# EAGLE design Seeeduino XIAO_v1.0_191112 (EAGLE 9.3.1)
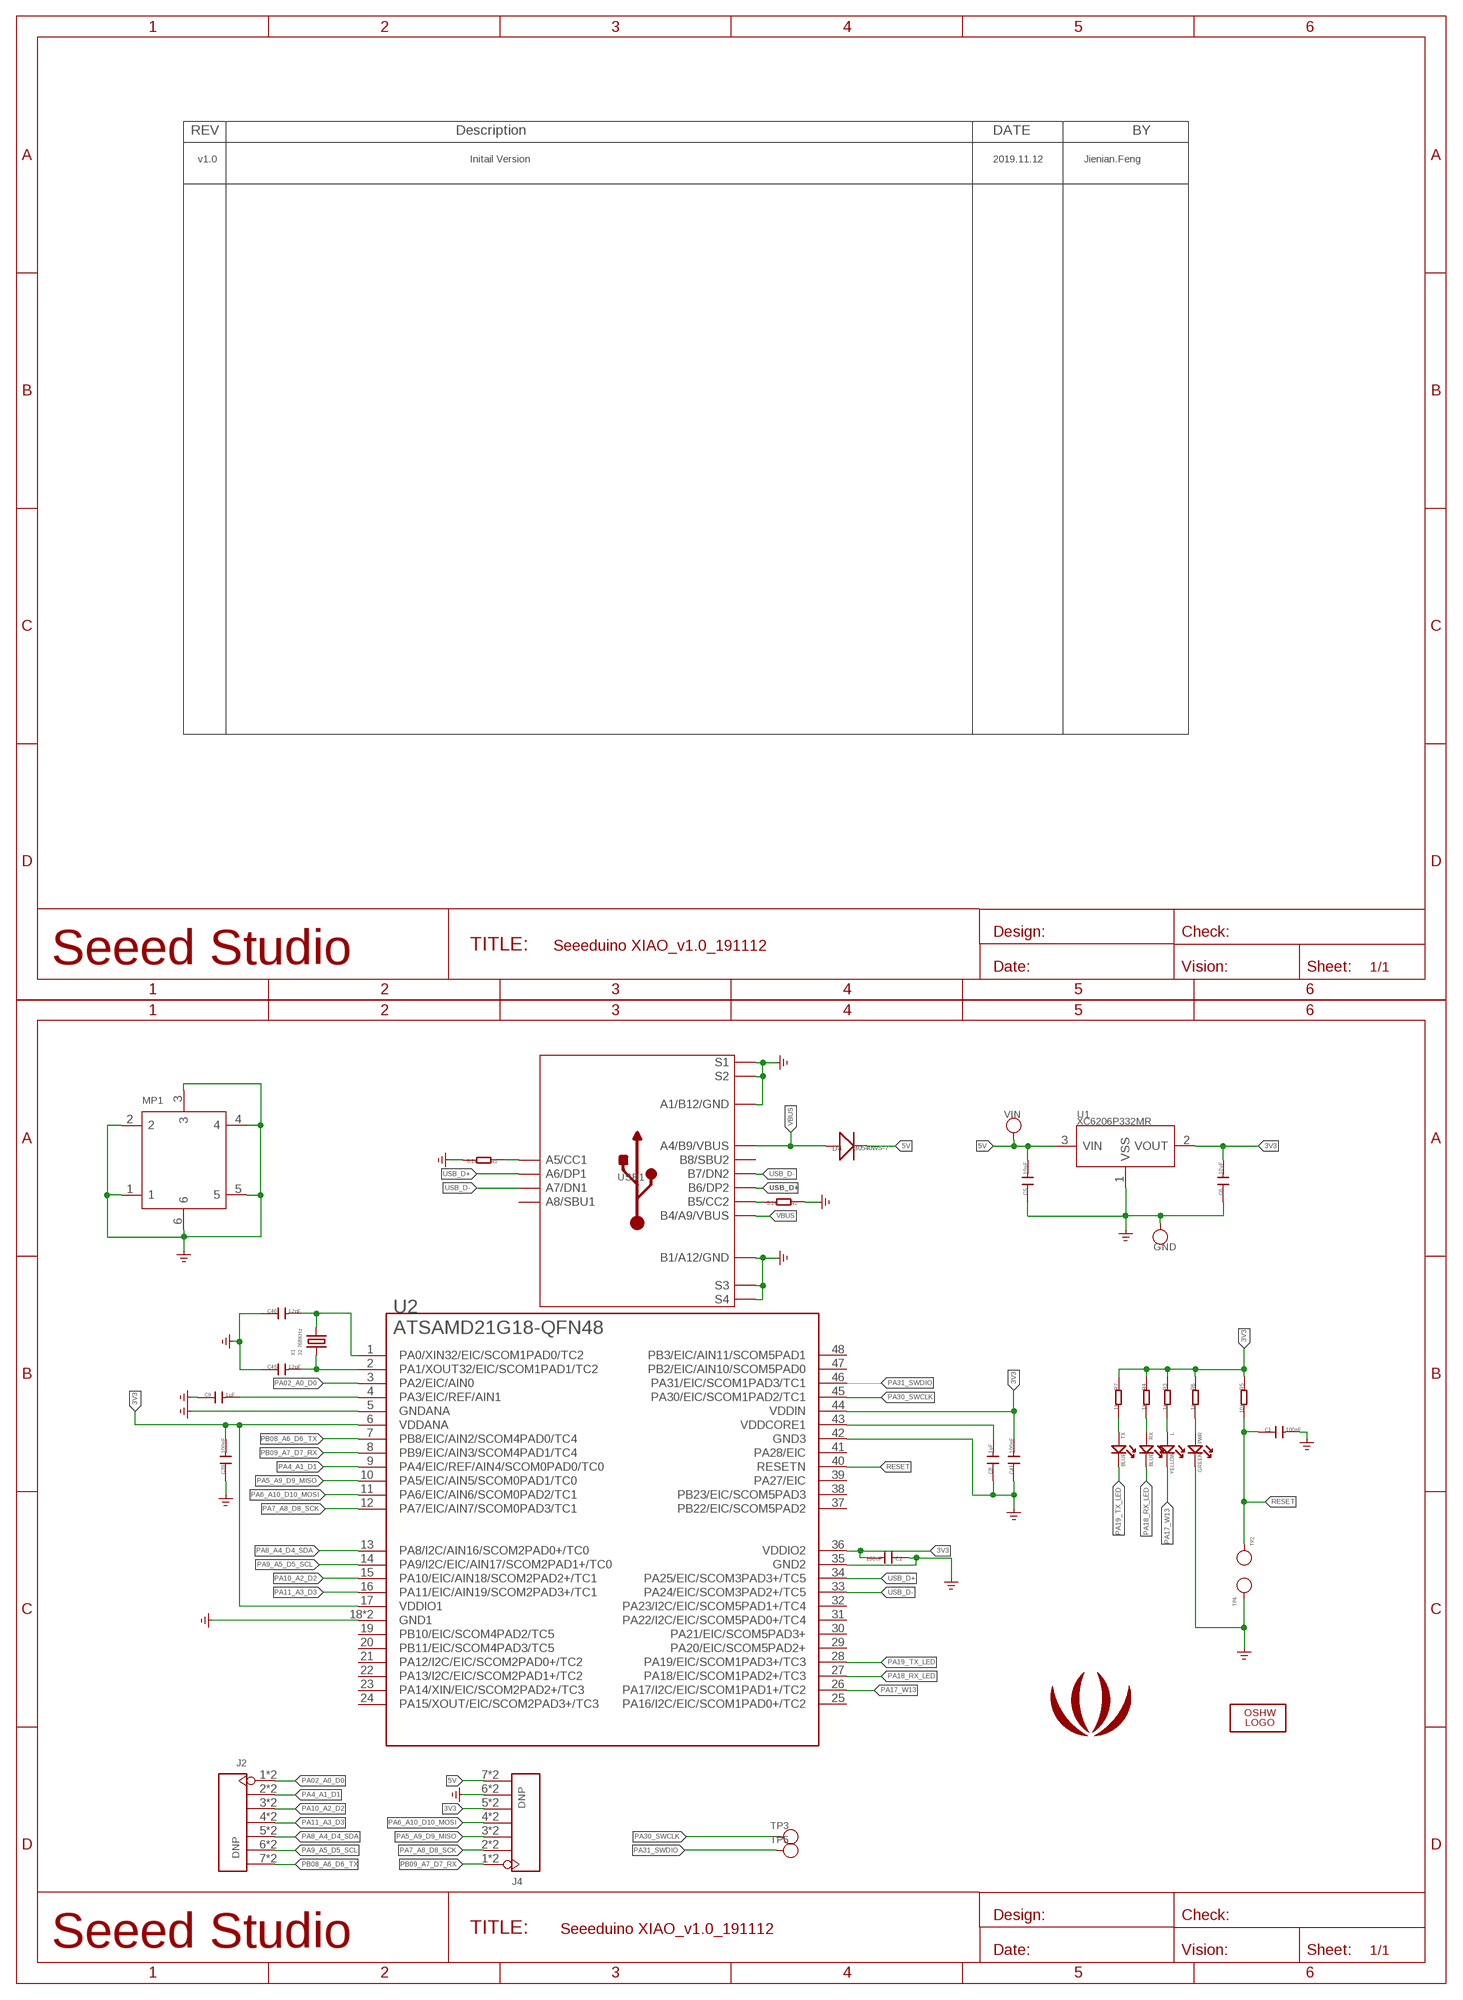
[diagram p0: schematic, sheet 1]

## Parts
C1  100nF  C-0402  [C0402]
C2  100nF  C-0402  [C0402]
C5  10uF  C-0603  [C0603]
C6  10uF  C-0603  [C0603]
C8  1uF  C-0402  [C0402]
C9  1uF  C-0402  [C0402]
C39  100nF  C-0402  [C0402]
C41  100nF  C-0402  [C0402]
C45  12pF  C-0402  [C0402]
C46  12pF  C-0402  [C0402]
D4  B0540WS-7  D'0805'  [SOD323]
GND  TEST-POINT'4080'  [TP-80X40MIL]
J2  DNP  HEADER-7P-HALF-HOLE-2.54  [H7-HALF-HOLE-2.54]
J4  DNP  HEADER-7P-HALF-HOLE-2.54  [H7-HALF-HOLE-2.54]
L  YELLOW  LED-0402  [LED-0402]
LOGO1  LOGO-OSHW-FILLX0200-NT  [OSHW_FILLX200_NOTEXT]
MP1  SHIELDING-COVER-12.3X11.9X0.2MM  [SHIELDING-COVER-12.3X11.9X0.2MM]
PWR  GREEN  LED-0402  [LED-0402]
R1  5.1k  R-0402  [R0402]
R2  5.1k  R-0402  [R0402]
R3  1k  R-0402  [R0402]
R4  1k  R-0402  [R0402]
R5  10k  R-0402  [R0402]
R6  1k  R-0402  [R0402]
R7  1k  R-0402  [R0402]
RX  BLUE  LED-0402  [LED-0402]
TP2  TEST-POINT'4545'  [TP-D45MIL]
TP3  TEST-POINT'4545'  [TP-D45MIL]
TP4  TEST-POINT'4545'  [TP-D45MIL]
TP5  TEST-POINT'4545'  [TP-D45MIL]
TX  BLUE  LED-0402  [LED-0402]
U1  XC6206P332MR  PMIC-XC6206PMR  [SOT-23]
U2  ATSAMD21G18-QFN48  [QFN48-7X7]
U$3  LOGO-SEEED-BIG-SILK  [SEEED-SILK-280*268MIL]
USB1  USB2.0-TYPE-C  [USB2.0-TYPE-C]
VIN  TEST-POINT'4080'  [TP-80X40MIL]
X1  32.768KHz  CRYSTAL-2P'NX2012SA'  [X2-SMD-L2.0X1.2X0.55MM]

## Nets
3V3: C2.2 C6.2 C39.2 C41.2 J4.5 J4.17 R3.1 R4.1 R5.1 R6.1 R7.1 U1.2(VOUT) U2.6(VDDANA) U2.17(VDDIO1) U2.36(VDDIO2) U2.44(VDDIN)
5V: C5.2 D4.- J4.7 J4.19 U1.3(VIN) VIN.1(T)
GND: C1.2 C2.1 C5.1 C6.1 C8.1 C9.1 C39.1 C41.1 C45.1 C46.1 GND.1(T) J4.6 J4.18 MP1.1 MP1.2 MP1.3 MP1.4 MP1.5 MP1.6 PWR.- R1.2 R2.1 TP4.T U1.1(VSS) U2.5(GNDANA) U2.18(GND1) U2.35(GND2) U2.42(GND3) U2.PAD(GND1) USB1.A1_B12(A1/B12/GND) USB1.B1_A12(B1/A12/GND) USB1.S1 USB1.S2 USB1.S3 USB1.S4 USB1.S5(S1) USB1.S6(S2) ; supply symbol labelled GND_POWER
N$1: R1.1 USB1.A5(A5/CC1)
N$2: R2.2 USB1.B5(B5/CC2)
N$3: C8.2 U2.43(VDDCORE1)
N$4: C9.2 U2.4(PA3/EIC/REF/AIN1)
N$5: L.+ R3.2
N$6: R7.2 TX.+
N$7: C45.2 U2.2(PA1/XOUT32/EIC/SCOM1PAD1/TC2) X1.2
N$9: R4.2 RX.+
N$11: C46.2 U2.1(PA0/XIN32/EIC/SCOM1PAD0/TC2) X1.1
N$16: PWR.+ R6.2
PA02_A0_D0: J2.1 J2.13 U2.3(PA2/EIC/AIN0)
PA4_A1_D1: J2.2 J2.14 U2.9(PA4/EIC/REF/AIN4/SCOM0PAD0/TC0)
PA5_A9_D9_MISO: J4.3 J4.15 U2.10(PA5/EIC/AIN5/SCOM0PAD1/TC0)
PA6_A10_D10_MOSI: J4.4 J4.16 U2.11(PA6/EIC/AIN6/SCOM0PAD2/TC1)
PA7_A8_D8_SCK: J4.2 J4.14 U2.12(PA7/EIC/AIN7/SCOM0PAD3/TC1)
PA8_A4_D4_SDA: J2.5 J2.17 U2.13(PA8/I2C/AIN16/SCOM2PAD0+/TC0)
PA9_A5_D5_SCL: J2.6 J2.18 U2.14(PA9/I2C/EIC/AIN17/SCOM2PAD1+/TC0)
PA10_A2_D2: J2.3 J2.15 U2.15(PA10/EIC/AIN18/SCOM2PAD2+/TC1)
PA11_A3_D3: J2.4 J2.16 U2.16(PA11/EIC/AIN19/SCOM2PAD3+/TC1)
PA17_W13: L.- U2.26(PA17/I2C/EIC/SCOM1PAD1+/TC2)
PA18_RX_LED: RX.- U2.27(PA18/EIC/SCOM1PAD2+/TC3)
PA19_TX_LED: TX.- U2.28(PA19/EIC/SCOM1PAD3+/TC3)
PA30_SWCLK: TP3.T U2.45(PA30/EIC/SCOM1PAD2/TC1)
PA31_SWDIO: TP5.T U2.46(PA31/EIC/SCOM1PAD3/TC1)
PB08_A6_D6_TX: J2.7 J2.19 U2.7(PB8/EIC/AIN2/SCOM4PAD0/TC4)
PB09_A7_D7_RX: J4.1 J4.13 U2.8(PB9/EIC/AIN3/SCOM4PAD1/TC4)
RESET: C1.1 R5.2 TP2.T U2.40(RESETN)
USB_D+: U2.34(PA25/EIC/SCOM3PAD3+/TC5) USB1.A6(A6/DP1) USB1.B6(B6/DP2)
USB_D-: U2.33(PA24/EIC/SCOM3PAD2+/TC5) USB1.A7(A7/DN1) USB1.B7(B7/DN2)
VBUS: D4.+ USB1.A4_B9(A4/B9/VBUS) USB1.B4_A9(B4/A9/VBUS)
Unconnected: U2.19(PB10/EIC/SCOM4PAD2/TC5) U2.20(PB11/EIC/SCOM4PAD3/TC5) U2.21(PA12/I2C/EIC/SCOM2PAD0+/TC2) U2.22(PA13/I2C/EIC/SCOM2PAD1+/TC2) U2.23(PA14/XIN/EIC/SCOM2PAD2+/TC3) U2.24(PA15/XOUT/EIC/SCOM2PAD3+/TC3) U2.25(PA16/I2C/EIC/SCOM1PAD0+/TC2) U2.29(PA20/EIC/SCOM5PAD2+) U2.30(PA21/EIC/SCOM5PAD3+) U2.31(PA22/I2C/EIC/SCOM5PAD0+/TC4) U2.32(PA23/I2C/EIC/SCOM5PAD1+/TC4) U2.37(PB22/EIC/SCOM5PAD2) U2.38(PB23/EIC/SCOM5PAD3) U2.39(PA27/EIC) U2.41(PA28/EIC) U2.47(PB2/EIC/AIN10/SCOM5PAD0) U2.48(PB3/EIC/AIN11/SCOM5PAD1) USB1.A8(A8/SBU1) USB1.B8(B8/SBU2)

## Notes on the sheet
- v1.0 | Initail Version | 2019.11.12 | Jienian.Feng

## Library data of the parts
C1 C2 C5 C6 C8 C9 C39 C41 C45 C46 = GroveX:C*: Ceramic Capacitors
D4 = Discrete-smallsmall:D*
GND VIN = Discrete-new:TEST-POINT
J2 J4 = Connector-new:HEADER-7P-HALF-HOLE
L PWR RX TX = Discrete-small:LED
LOGO1 = logo:LOGO-OSHW-FILL; PARTNO: DNP
MP1 = moudle-new:SHIELDING-COVER-12.3X11.9X0.2MM
R1-R7 = GroveX:R*
TP2-TP5 = Discrete-new:TEST-POINT; PARTNO: DNP
U1 = G2:PMIC-XC6206P: LOW ESR Cap.Compatible Positive Voltage Regulators
U2 = AMLib_New:ATSAMD21G18: Atmel D21 32bit ARM Cortex-M0 microcontroller - 48 PIN TQFP 256KB flash memory + 32KB SRAM
U$3 = logo:LOGO-SEEED; PARTNO: DNP
USB1 = USB C:USB2.0-TYPE-C
X1 = Discrete-new:CRYSTAL-2P

## Net classes
1 power: width 0.152 mm, drill 0.152 mm, clearance 0.152 mm
2 gnd: width 0.152 mm, drill 0.152 mm, clearance 0.152 mm
3 usbvcc: width 0.152 mm, drill 0.152 mm, clearance 0.152 mm

## Board
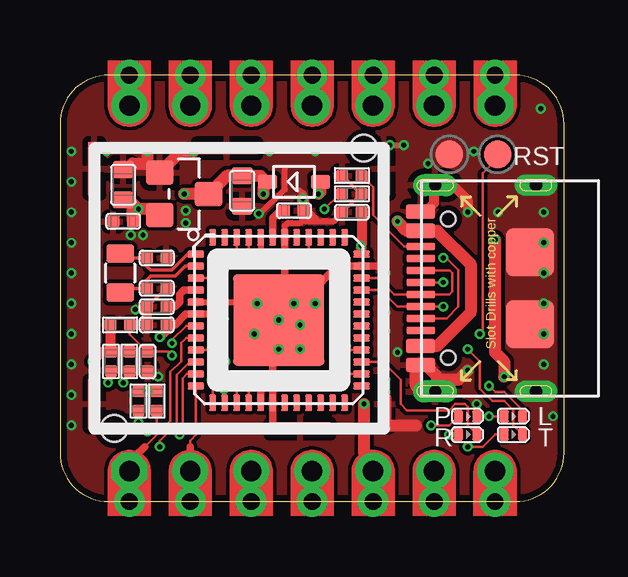
[diagram p1: board, top side]
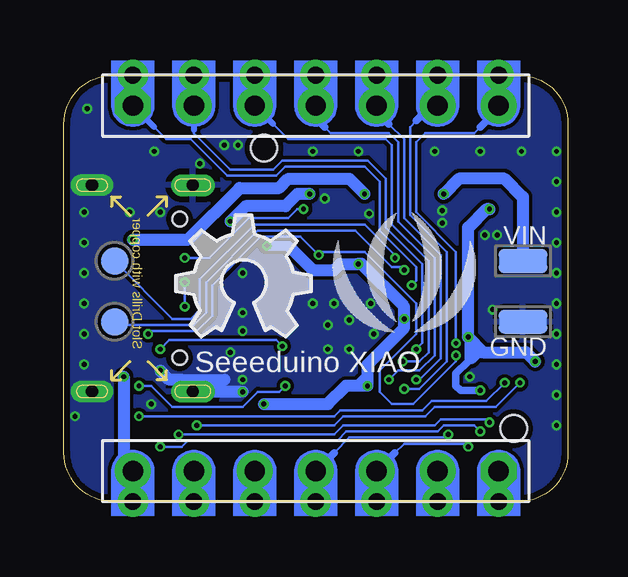
[diagram p2: board, bottom side, seen from below]

Size 21 x 17.78 mm. Coordinates in mm from the lower left corner, seen from the top.
Outline: 2.03,0 18.97,0 arc90 21,2.03 21,15.75 arc90 18.97,17.78 2.03,17.78 arc90 0,15.75 0,2.03 arc90 2.03,0
Copper layers (1*16): Top 0.035mm / dielectric 1.5mm / Bottom 0.035mm
Design rules "SeeedStudio_2layer_DRU_no_angle_20140221 *": minimum track width 1mil, minimum drill 8mil, track to track 4mil, track to pad 4mil, pad to pad 4mil, via to via 4mil, smd to smd 0mil, copper to edge 10mil, drill to drill 10mil, minimum pad ring 4mil, minimum via ring 4mil, stop-mask expansion 2mil, vias tented up to drill 25mil, thermal gap 10mil
tRestrict: area 6.2,4.4 to 11.9,10.3

### Footprints (pad centres in the part's own frame; a part is rotated, then mirrored left to right if it is on the bottom)
C0402 = smd 0.508 x 0.508: 1 -0.406,0; 2 0.406,0
C0603 = smd 0.699 x 0.862: 1 -0.635,0; 2 0.635,0
SOD323 = smd 0.8 x 0.6: + -1.1,0; - 1.1,0
TP-80X40MIL = smd 2.032 x 1.016: 1 0,0
H7-HALF-HOLE-2.54 = drill 0.85 pad 1.5 octagon: 1 0,7.62 | drill 0.85 pad 1.5: 2 0,5.08; 3 0,2.54; 4 0,0; 5 0,-2.54; 6 0,-5.08; 7 0,-7.62 | drill 0.7 pad 1.27: 13 -1.27,7.62; 14 -1.27,5.08; 15 -1.27,2.54; 16 -1.27,0; 17 -1.27,-2.54; 18 -1.27,-5.08; 19 -1.27,-7.62
LED-0402 = smd 0.385 x 0.508: + -0.383,0; - 0.383,0
SHIELDING-COVER-12.3X11.9X0.2MM = smd 0.5 x 2.032: 1 -6.032,-4.82; 5 6.032,-4.82 | smd 0.5 x 2.2: 2 -6.032,5; 4 6.032,5 | smd 2.54 x 0.5: 3 -0.508,5.842; 6 2.54,-5.842 | hole 1.1: -5.2,-5.842; 5.2,5.842
R0402 = smd 0.508 x 0.508: 1 -0.406,0; 2 0.406,0
TP-D45MIL = smd 1.143 x 1.143: T 0,0
SOT-23 = smd 1.016 x 1.143: 1 -0.889,-1.016; 2 0.889,-1.016; 3 0,1.016
QFN48-7X7 = smd 0.7 x 0.3: 1 -3.45,2.75; 2 -3.45,2.25; 3 -3.45,1.75; 4 -3.45,1.25; 5 -3.45,0.75; 6 -3.45,0.25; 7 -3.45,-0.25; 8 -3.45,-0.75; 9 -3.45,-1.25; 10 -3.45,-1.75; 11 -3.45,-2.25; 12 -3.45,-2.75; 25 3.45,-2.75; 26 3.45,-2.25; 27 3.45,-1.75; 28 3.45,-1.25; 29 3.45,-0.75; 30 3.45,-0.25; 31 3.45,0.25; 32 3.45,0.75; 33 3.45,1.25; 34 3.45,1.75; 35 3.45,2.25; 36 3.45,2.75 | smd 0.3 x 0.7: 13 -2.75,-3.45; 14 -2.25,-3.45; 15 -1.75,-3.45; 16 -1.25,-3.45; 17 -0.75,-3.45; 18 -0.25,-3.45; 19 0.25,-3.45; 20 0.75,-3.45; 21 1.25,-3.45; 22 1.75,-3.45; 23 2.25,-3.45; 24 2.75,-3.45; 37 2.75,3.45; 38 2.25,3.45; 39 1.75,3.45; 40 1.25,3.45; 41 0.75,3.45; 42 0.25,3.45; 43 -0.25,3.45; 44 -0.75,3.45; 45 -1.25,3.45; 46 -1.75,3.45; 47 -2.25,3.45; 48 -2.75,3.45 | smd 3.81 x 3.81: PAD 0,0
USB2.0-TYPE-C = smd 1.2 x 0.6: A1_B12 0.05,3.2; A4_B9 0.05,2.4; B1_A12 0.05,-3.2; B4_A9 0.05,-2.4 | smd 1.2 x 0.3: A5 0.05,1.25; A6 0.05,0.25; A7 0.05,-0.25; A8 0.05,-1.25; B5 0.05,-1.75; B6 0.05,-0.75; B7 0.05,0.75; B8 0.05,1.75 | drill 0.508 pad 0.889 long: S1 -4.75,4.3; S2 -4.75,-4.3 | drill 0.508 pad 0.914 long: S3 -0.55,4.3; S4 -0.55,-4.3 | smd 2 x 2: S5 -4.5,1.5; S6 -4.5,-1.5 | hole 0.6: -1.1,-2.89; -1.1,2.89
X2-SMD-L2.0X1.2X0.55MM = smd 0.762 x 1.143: 1 -0.813,0; 2 0.813,0

### Placement (x,y rotation side)
C1  3.65,5.84 270 top
C2  12.16,12.07 0 top
C5  7.59,12.95 90 top
C6  2.63,13.21 270 top
C8  9.75,12.13 180 top
C9  4.03,8.13 0 top
C39  2.63,11.68 0 top
C41  4.03,7.37 0 top
C45  4.03,8.89 180 top
C46  4.03,10.16 180 top
D4  9.75,13.34 180 top
GND  1.87,7.49 0 bottom
J2  10.51,16.51 270 top
J4  10.51,1.27 90 top
L  18.89,3.56 0 top
LOGO1  16.35,6.86 0 bottom
MP1  7.46,8.89 0 top
PWR  16.98,3.56 0 top
R1  12.16,12.83 0 top
R2  12.16,13.59 0 top
R3  2.89,5.84 270 top
R4  3.27,4.19 270 top
R5  2.51,7.37 0 top
R6  2.13,5.84 270 top
R7  4.03,4.19 270 top
RX  16.98,2.79 0 top
TP2  18.23,14.48 90 top
TP3  18.89,7.49 0 bottom
TP4  16.22,14.48 0 top
TP5  18.89,10.03 0 bottom
TX  18.89,2.79 0 top
U1  5.17,12.83 270 top
U2  9.11,7.57 0 top
U$3  6.83,8.76 0 bottom
USB1  15.08,8.89 180 top
VIN  1.87,10.03 180 bottom
X1  2.51,9.53 270 top

### Tracks (layer width: path | path; a pad name or v marks a point on that pad's centre or on a via)
3V3  (via drill 0.2 pad 0.41)
  Top 0.102: C41.2 4.41,7.37
  Top 0.254: U2.44 8.36,10.28 v8.73,9.91
  Top 0.305: v6.82,7.62 v6.83,7.62 6.63,7.82 U2.6 5.24,7.82 4.79,7.37 4.41,7.37 | U2.17 8.36,4.81 v8.35,4.83 | U2.36 12.56,10.52
  Top 0.406: R3.1 2.28,6.25 2.25,6.22 2.15,6.22 R6.1 | R5.1 2.1,6.27 R6.1 | C41.2 4.44,7.14 v4.16,6.86 | R7.1 3.99,4.64 v3.65,4.64 3.61,4.6 R4.1 | R6.1 1.77,6.25 v1.36,5.84 | C2.2 12.56,10.69 v12.54,10.67 12.56,10.65 12.56,10.52
  Top 0.508: C39.2 3.04,11.96 | 3.04,11.96 v3.27,12.19 | U1.2 4.16,12.07 4.03,12.19 v3.27,12.19 | C6.2 2.89,12.57 3.04,12.42 | 3.04,12.42 v3.27,12.19 | 3.04,11.96 3.04,12.42 | J4.5 13.05,1.65 12.67,2.03 v12.67,4.06
  Bottom 0.305: v3.65,4.64 4.48,4.64 4.67,4.83 4.67,5.33 4.16,5.84 4.16,6.22 | 4.16,6.22 v4.16,6.86 | 4.16,6.22 3.52,6.22
  Bottom 0.406: v12.54,10.67 11.65,10.67 11.52,10.54
  Bottom 0.508: v3.27,12.19 3.4,12.19 4.16,11.43 v4.16,6.86 3.52,6.22 | 8.35,5.21 v8.35,4.83 8.73,4.83 | 8.35,5.21 8.35,5.72 6.83,7.24 v6.83,7.62 6.83,8.13 8.6,9.91 v8.73,9.91 9.49,9.91 9.75,9.65 10.63,9.65 11.52,10.54 | v12.67,4.06 10,4.06 9.24,4.83 8.73,4.83 | J4.5 J4.17 | 3.52,6.22 3.78,6.22 4.03,5.97 | 8.35,5.21 8.73,4.83 | 3.52,6.22 1.74,6.22 v1.36,5.84
5V  (via drill 0.2 pad 0.41)
  Top 0.508: 8.6,13.34 D4.- | v5.17,12.83 U1.3 6.95,13.59 C5.2 8.35,13.59 8.6,13.34 | 8.6,13.34 8.6,13.21 8.48,13.08 v8.48,12.83 | v18.51,5.21 18.51,5.84 18.13,6.22 v18.13,10.92
  Bottom 0.508: v5.17,12.83 4.54,13.46 2.63,13.46 1.87,12.7 VIN.1 1.49,10.03 | v18.13,10.92 15.84,10.92 13.68,13.08 12.03,13.08 11.65,13.46 9.11,13.46 v8.48,12.83 | v18.51,5.21 18.51,1.65 J4.7 J4.19
GND  (via drill 0.2 pad 0.41)
  Top 0.102: 13.3,4.06 13.31,4.07 MP1.5 13.43,4.06 13.43,3.94 13.56,4.06 13.56,4.32 v13.56,5.08
  Top 0.152: 12.54,12.83 11.78,12.07 C2.1 | R1.2 12.54,12.83 | 12.54,12.83 11.78,13.59 R2.1 | C9.1 3.65,8.13 4.41,8.89 C45.1
  Top 0.254: 9.37,13.84 9.37,13.02 8.35,12 v8.29,12 | 10.15,12.8 10.13,12.83 10,12.95 | 8.08,8.12 v8.22,8.26 8.16,8.32 U2.5 | 9.36,11.3 9.36,11.49 9.49,11.62 10,11.62 10.15,11.77 C8.1 | C2.1 11.75,12.04 11.4,11.68 10.76,11.68 | 10.76,11.68 10.63,11.81 | 10.63,11.81 10.32,12.13 C8.1 | C8.1 10.15,12.68 | 10.15,12.68 10.13,12.7 | 10.63,11.81 10.25,11.81 | 10.76,11.68 10.25,11.68 | C8.1 10.15,12.17 10,12.32 10,12.7 | C8.1 10.15,12.22 10.25,12.32 10.25,12.57 10.15,12.68 | v13.75,14.86 v14.32,14.86
  Top 0.305: v9.11,6.35 8.86,6.1 U2.18 8.86,3.17 8.98,3.05 MP1.6 | 9.36,11.3 U2.42 9.36,8.64 | v3.14,8 3.5,8 C9.1 | 13.46,9.62 v13.56,9.53 13.27,9.82 U2.35 11.56,9.82 10.38,8.64 10.25,8.64 | 9.36,8.64 9.36,8.51 | v10.13,12.64 10.13,12.7 10.13,12.83 | C1.2 3.67,5.44 3.9,5.21 4.03,5.21 | 9.36,8.64 v9.75,8.26
  Top 0.406: USB1.B1_A12 15.23,12.09 15.59,12.45 15.59,13.21 16.35,13.21 16.98,12.57 v16.98,12.07 | C41.1 3.62,8.1 3.65,8.13
  Top 0.508: v5.55,14.61 5.05,14.61 U1.1 4.03,13.72 3.65,14.1 | 3.65,14.1 v3.65,14.61 | C6.1 2.76,13.84 3.01,14.1 3.65,14.1 | USB1.A1_B12 15.23,5.69 15.71,5.21 15.71,5.08 | v16.98,5.46 16.6,5.08 15.71,5.08 | 15.71,5.08 15.71,4.57 15.08,4.57 14.83,4.83 14.83,5.46 14.7,5.59 | 13.56,4.32 13.56,3.3 13.68,3.18 14.83,3.18
  Bottom 0.508: v13.56,4.57 15.61,4.57 | 15.61,4.57 USB1.S3 | 15.61,4.57 15.61,4.6 16.1,5.08 | 16.1,5.08 16.6,5.08 v16.98,5.46 | 16.1,5.08 14.32,5.08
  other vias: 17.24,14.61 13.56,7.87 9.11,7.57 10,7.37 8.1,6.99 10,6.35 10.63,8.26 0.47,12.07 2.95,11.11 3.46,11.11 0.47,4.45 0.47,3.18 1.94,14.61 8.73,14.61 10.63,14.61 0.47,13.34 0.47,14.61 15.33,14.1 20.16,10.79 20.16,5.72 0.47,10.79 0.47,9.53 0.47,5.72 20.16,12.07 0.47,8.26 0.47,6.99 20.03,16.38 20.16,6.99 20.16,8.26 20.16,9.53 4.09,5.21 17.37,4.06 20.54,3.56 14.06,6.22 13.56,7.11 18.26,12.07 5.24,12.13 5.24,11.62
  pour Bottom (isolate 0.152): -0.16,17.78 -0.16,0 21.43,0 21.43,17.78
  pour Top (isolate 0.152): -0.16,17.78 21.43,17.78 21.43,0 -0.16,0
N$1  (via drill 0.2 pad 0.41)
  Top 0.102: R1.1 11.75,12.8 11.63,12.8 v11.02,12.19 | v15.97,10.16 16.1,10.16 16.6,9.65 16.6,8.13 16.12,7.64 USB1.A5
  Bottom 0.102: v11.02,12.19 11.27,12.19 11.65,11.81 13.3,11.81 14.95,10.16 v15.97,10.16
N$2
  Top 0.102: USB1.B5 14.35,10.64 13.05,11.94 13.05,13.11 R2.2
N$3
  Top 0.305: U2.43 8.86,11.82 9.05,12 9.11,12.07 9.17,12.13 C8.2
N$4
  Top 0.305: C9.2 4.79,8.13 4.98,8.32 4.98,8.64 5.08,8.73 5.11,8.76 5.16,8.82 U2.4
N$5  (via drill 0.2 pad 0.41)
  Top 0.102: R3.2 2.89,5.21 v2.63,4.95 | L.+ v17.88,3.56 v17.87,3.56
  Bottom 0.102: v2.63,4.95 3.4,4.19 5.68,4.19 6.06,3.81 9.49,3.81 9.75,3.56 v17.87,3.56
N$6  (via drill 0.2 pad 0.41)
  Top 0.102: R7.2 4.03,3.3 v3.65,2.92 | TX.+ 18.13,2.79 17.62,2.29 v16.98,2.29
  Bottom 0.102: v3.65,2.92 3.9,3.18 5.17,3.18 5.43,2.92 9.24,2.92 9.62,2.54 15.84,2.54 16.1,2.29 v16.98,2.29
N$7
  Top 0.152: X1.2 2.68,8.89 C45.2 3.62,9.25 3.78,9.4 4.79,9.4 5.21,9.82 U2.2
N$9  (via drill 0.2 pad 0.41)
  Top 0.102: R4.2 v3.27,3.3 | RX.+ v16.22,2.79
  Bottom 0.102: v3.27,3.3 3.4,3.43 5.3,3.43 5.55,3.18 9.37,3.18 9.75,2.79 v16.22,2.79
N$11
  Top 0.152: X1.1 2.68,10.16 C46.2 3.62,9.8 3.78,9.65 4.67,9.65 5.33,10.32 U2.1
N$16  (via drill 0.2 pad 0.41)
  Top 0.102: PWR.+ 16.22,3.18 v15.46,3.18 | R6.2 2.13,5.08 v2,4.95
  Bottom 0.102: v15.46,3.18 9.75,3.18 9.37,3.56 5.94,3.56 5.55,3.94 3.01,3.94 v2,4.95
PA02_A0_D0  (via drill 0.2 pad 0.41)
  Top 0.102: U2.3 6.21,9.32 v6.51,9.02
  Bottom 0.102: J2.1 17.87,16.26 | 17.24,15.62 16.73,15.11 15.71,15.11 14.19,13.59 12.16,13.59 11.78,13.97 8.48,13.97 7.84,13.34 7.84,11.3 6.32,9.78 6.32,9.21 v6.51,9.02
  Bottom 0.254: 17.87,16.26 17.24,15.62 | J2.1 J2.13
PA4_A1_D1  (via drill 0.2 pad 0.41)
  Top 0.102: U2.9 6.28,6.32 v6.32,6.35
  Bottom 0.102: J2.2 15.59,16 | 15.59,15.49 15.59,15.37 14.06,13.84 12.29,13.84 11.9,14.22 8.35,14.22 7.59,13.46 7.59,11.43 6.06,9.91 6.06,6.6 v6.32,6.35
  Bottom 0.254: 15.59,16 15.59,15.49 | J2.2 J2.14
PA5_A9_D9_MISO  (via drill 0.2 pad 0.41)
  Top 0.102: v4.16,2.29 4.16,2.54 4.86,3.24 4.86,5.27 5.4,5.82 U2.10
  Bottom 0.102: 7.21,2.03 6.83,2.41 4.29,2.41 v4.16,2.29
  Bottom 0.305: J4.3 7.21,2.03
  Bottom 0.508: J4.3 J4.15
PA6_A10_D10_MOSI  (via drill 0.2 pad 0.41)
  Top 0.102: v4.98,2.79 5.11,2.92 5.11,5.14 5.28,5.32 U2.11
  Bottom 0.102: 9.75,2.03 9.11,2.67 5.11,2.67 v4.98,2.79 | 10.38,1.4 J4.4
  Bottom 0.305: 10.38,1.4 9.75,2.03
  Bottom 0.508: J4.4 J4.16
PA7_A8_D8_SCK
  Top 0.102: U2.12 5.66,2.77 5.43,2.54 5.43,2.29
  Top 0.305: J4.2 5.43,2.29
  Bottom 0.508: J4.2 J4.14
PA8_A4_D4_SDA  (via drill 0.2 pad 0.41)
  Top 0.102: U2.13 6.36,5.04 v6.32,5.08
  Bottom 0.102: J2.5 7.97,16.26 7.71,16 | 7.46,15.75 6.83,15.11 6.83,11.81 5.3,10.29 5.3,5.97 6.19,5.08 v6.32,5.08
  Bottom 0.254: J2.5 J2.17
  Bottom 0.305: 7.71,16 7.46,15.75
PA9_A5_D5_SCL  (via drill 0.2 pad 0.41)
  Top 0.102: U2.14 6.86,4.66 v6.83,4.7
  Bottom 0.102: J2.6 5.68,16.51 5.94,16.26 | 6.32,15.88 6.57,15.62 6.57,11.94 5.05,10.41 5.05,5.84 6.19,4.7 v6.83,4.7
  Bottom 0.254: J2.6 J2.18
  Bottom 0.305: 5.94,16.26 6.32,15.88
PA10_A2_D2  (via drill 0.2 pad 0.41)
  Top 0.102: U2.15 7.36,4.67 6.89,5.14 v6.89,5.84
  Bottom 0.102: J2.3 12.67,16.13 | 12.29,15.75 11.65,15.11 7.59,15.11 7.33,14.86 7.33,11.56 5.81,10.03 5.81,6.22 6.19,5.84 v6.89,5.84
  Bottom 0.254: 12.67,16.13 12.29,15.75 | J2.3 J2.15
PA11_A3_D3  (via drill 0.2 pad 0.41)
  Top 0.102: U2.16 7.86,4.68 v7.46,5.08
  Bottom 0.102: J2.4 10.51,16 10.38,15.88 | 10.13,15.62 9.87,15.37 7.46,15.37 7.08,14.99 7.08,11.68 5.55,10.16 5.55,6.1 6.19,5.46 7.08,5.46 v7.46,5.08
  Bottom 0.254: J2.4 J2.16
  Bottom 0.305: 10.38,15.88 10.13,15.62
PA17_W13  (via drill 0.2 pad 0.41)
  Top 0.102: L.- 19.27,3.81 18.51,4.57 18.13,4.57 v17.87,4.83 | U2.26 12.01,5.32 11.78,5.08 v11.78,4.83
  Bottom 0.102: v17.87,4.83 17.37,4.83 16.48,3.94 13.56,3.94 12.92,4.57 12.03,4.57 v11.78,4.83
PA18_RX_LED
  Top 0.102: RX.- 16.98,3.18 16.98,3.94 16.86,4.06 16.48,4.06 16.22,3.81 14.45,3.81 14.19,4.06 14.19,5.08 13.46,5.82 U2.27
PA19_TX_LED  (via drill 0.2 pad 0.41)
  Top 0.102: TX.- 18.89,3.18 18.89,3.81 18.51,4.19 18,4.19 17.49,4.7 17.49,5.84 v16.98,6.35 | U2.28 12.07,6.32 v11.9,6.48
  Bottom 0.102: v16.98,6.35 16.6,6.73 12.16,6.73 v11.9,6.48
PA30_SWCLK  (via drill 0.2 pad 0.41)
  Top 0.102: U2.45 7.86,10.18 7.46,9.78 6.95,9.78 v6.83,9.65
  Bottom 0.102: TP3.T 18.76,7.37 15.59,7.37 15.08,7.87 15.08,9.14 12.92,11.3 8.86,11.3 7.33,9.78 6.95,9.78 v6.83,9.65
PA31_SWDIO  (via drill 0.2 pad 0.41)
  Top 0.102: U2.46 7.36,10.32 v7.21,10.16
  Bottom 0.102: v7.21,10.16 7.21,10.29 8.48,11.56 13.05,11.56 15.33,9.27 15.33,8 15.71,7.62 16.48,7.62 TP5.T
PB08_A6_D6_TX  (via drill 0.2 pad 0.41)
  Top 0.102: U2.7 5.25,7.32 4.67,6.73 v4.67,6.6
  Bottom 0.102: J2.7 2.89,16.38 3.14,16.13 | 3.65,15.62 3.9,15.37 5.94,15.37 6.32,14.99 6.32,12.07 4.67,10.41 v4.67,6.6
  Bottom 0.254: J2.7 J2.19
  Bottom 0.305: 3.14,16.13 3.65,15.62
PB09_A7_D7_RX
  Top 0.102: 2.89,1.65 3.14,1.91 | 3.52,2.29 4.6,3.37 4.6,5.4 5.05,5.84 5.05,6.6 5.26,6.82 U2.8
  Top 0.305: 3.14,1.91 3.52,2.29 | 2.89,1.65 J4.1
  Bottom 0.508: J4.1 J4.13
RESET  (via drill 0.2 pad 0.41)
  Top 0.102: U2.40 10.36,10.31 v10.38,10.29 | R5.2 2.91,6.96 3.62,6.25 C1.1 4.51,6.25 v4.67,6.1 | TP2.T 18.23,14.31 17.62,13.7 17.62,7.11 v17.49,6.99
  Bottom 0.102: v17.49,6.99 17.37,7.11 15.46,7.11 14.83,7.75 14.83,9.02 12.79,11.05 11.14,11.05 v10.38,10.29 10.25,10.41 8.48,10.41 6.32,8.26 6.32,6.99 7.84,5.46 7.84,4.57 7.33,4.06 6.44,4.06 4.67,5.84 v4.67,6.1
USB_D+
  Top 0.102: USB1.B6 16.23,9.64 16.35,9.53 16.35,8.76 16.23,8.64 USB1.A6 13.93,8.64 13.26,9.32 U2.34
USB_D-  (via drill 0.2 pad 0.41)
  Top 0.102: USB1.A7 v15.96,9.14 v15.97,9.14 | v15.97,8.13 15.96,8.14 USB1.B7 14.05,8.14 13.68,8.51 13.58,8.62 13.38,8.82 U2.33
  Bottom 0.102: v15.97,9.14 v15.97,8.13
VBUS  (via drill 0.2 pad 0.41)
  Top 0.508: D4.+ 10.85,12.91 v10.76,12.83 | v14.06,11.68 14.46,11.29 USB1.B4_A9 15.73,11.29 17.11,9.91 17.11,7.87 15.73,6.49 USB1.A4_B9
  Bottom 0.508: v10.76,12.83 11.27,12.83 11.78,12.32 13.43,12.32 v14.06,11.68

### Text on the board
tNames: RST | P | L | R | T
bNames: VIN | GND | Seeeduino XIAO
tTest: J4